# Altium schematic sheet 0002_INDEX -1.SchDoc
size 891 x 558 mm
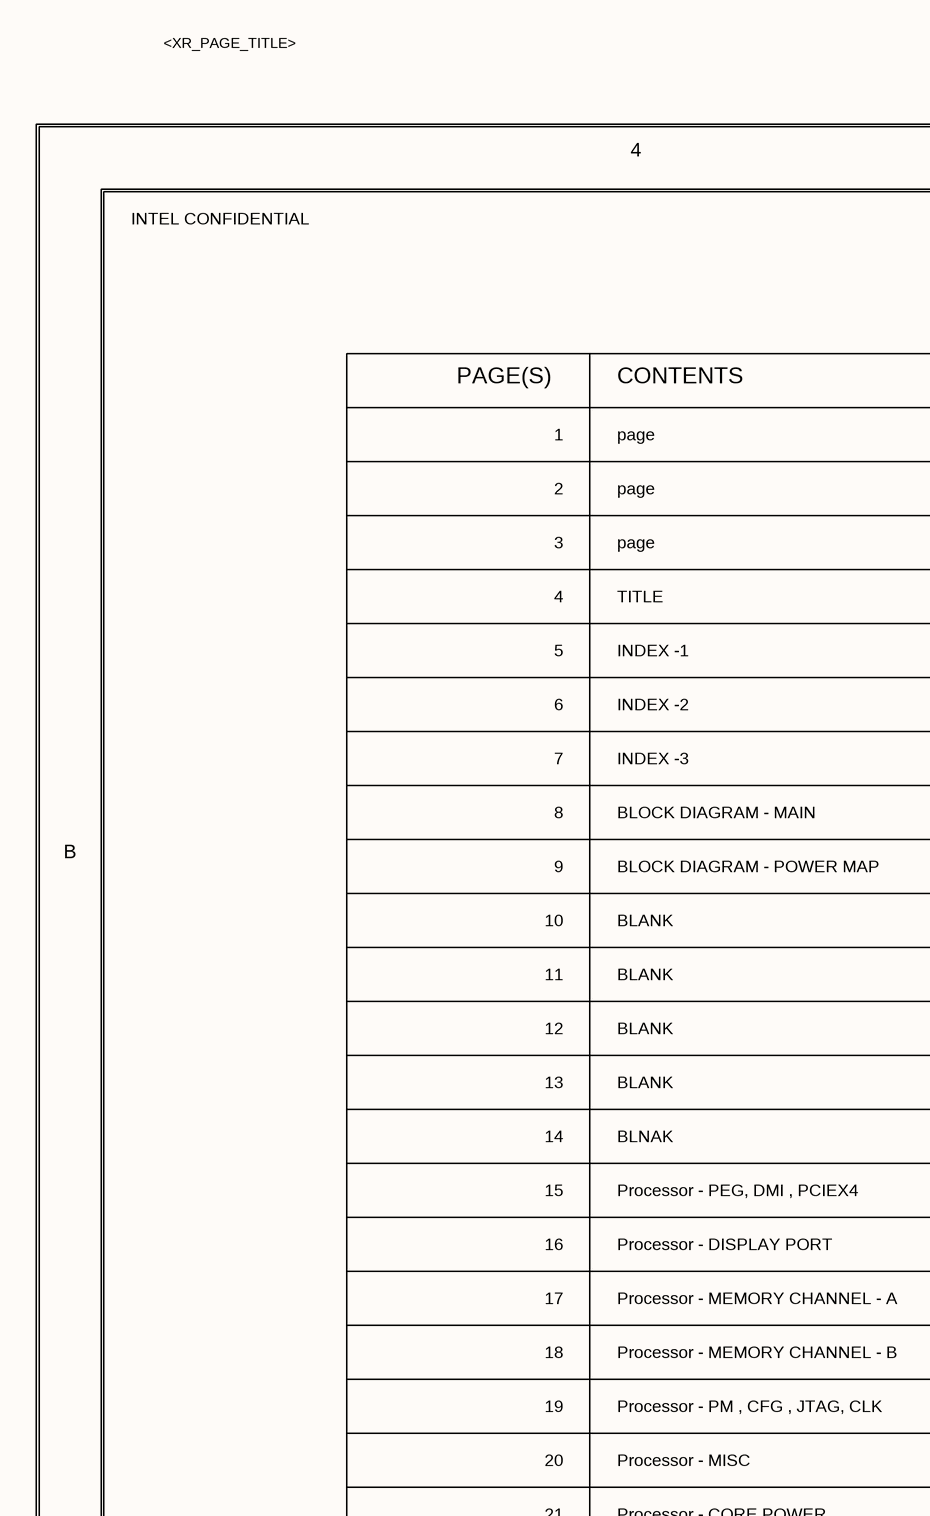
[diagram p0: 0002_INDEX -1.SchDoc, top left]
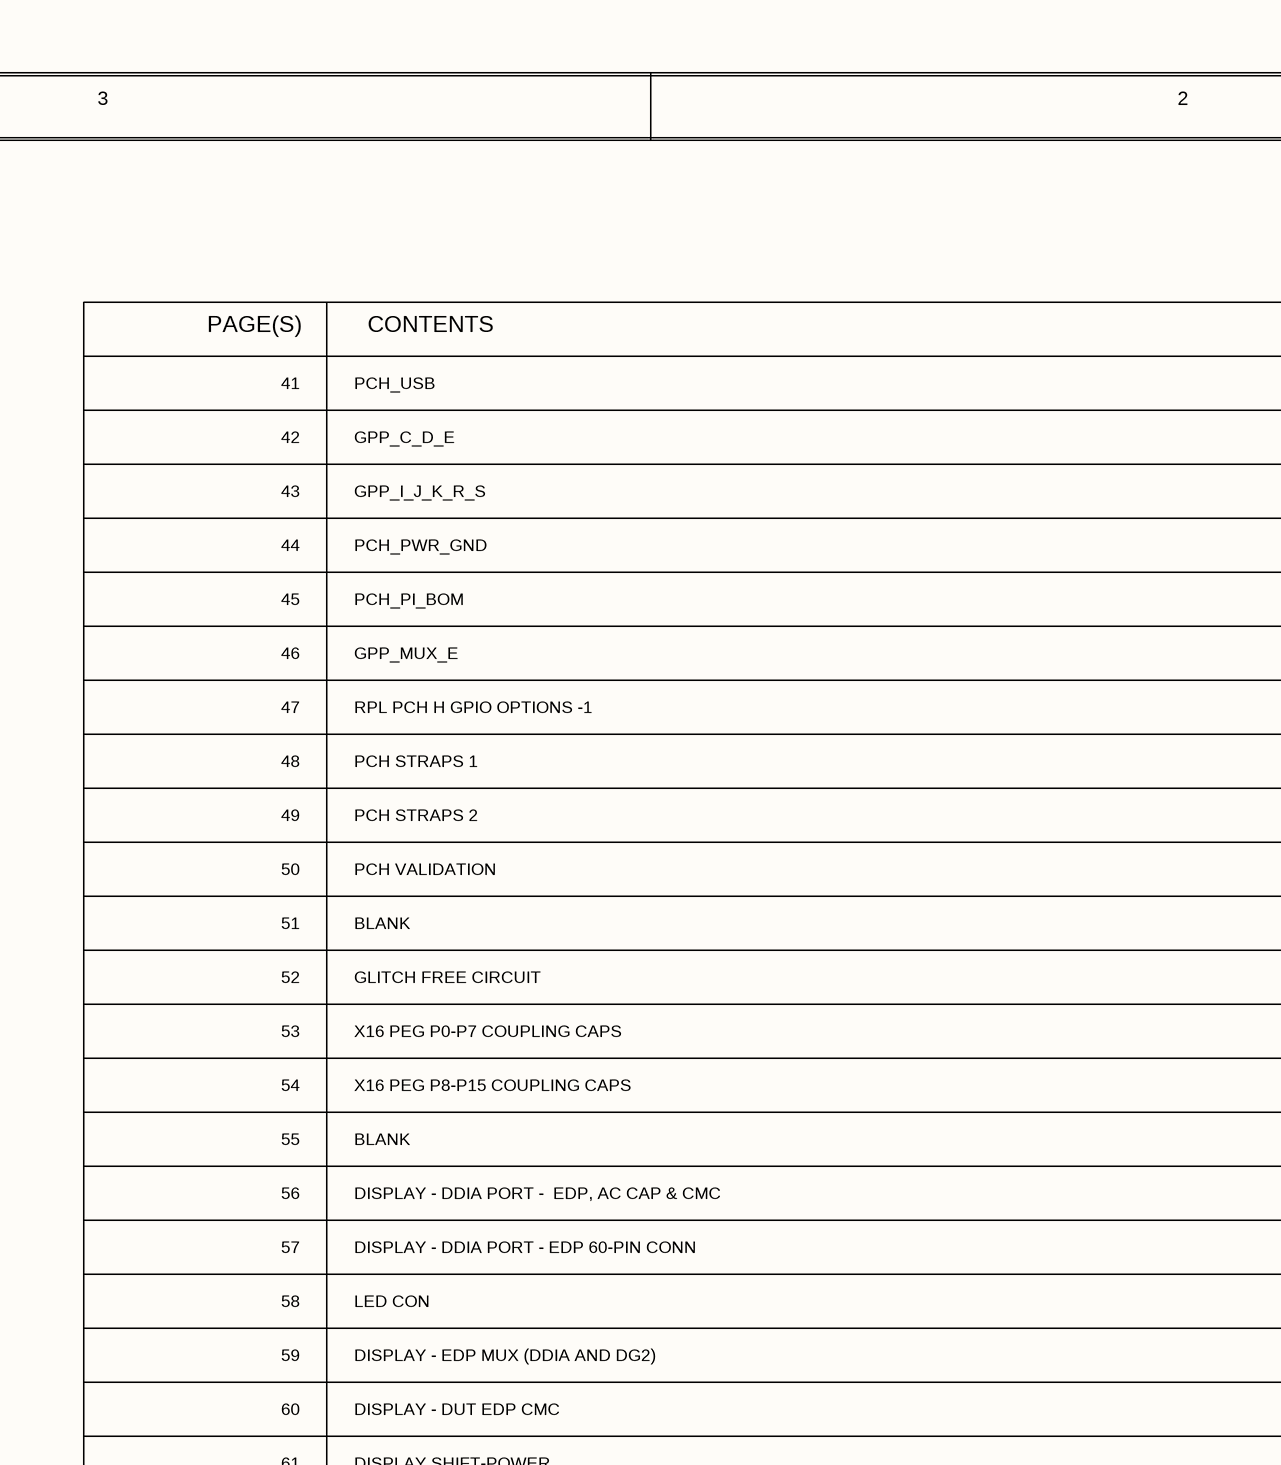
[diagram p1: 0002_INDEX -1.SchDoc, top middle]
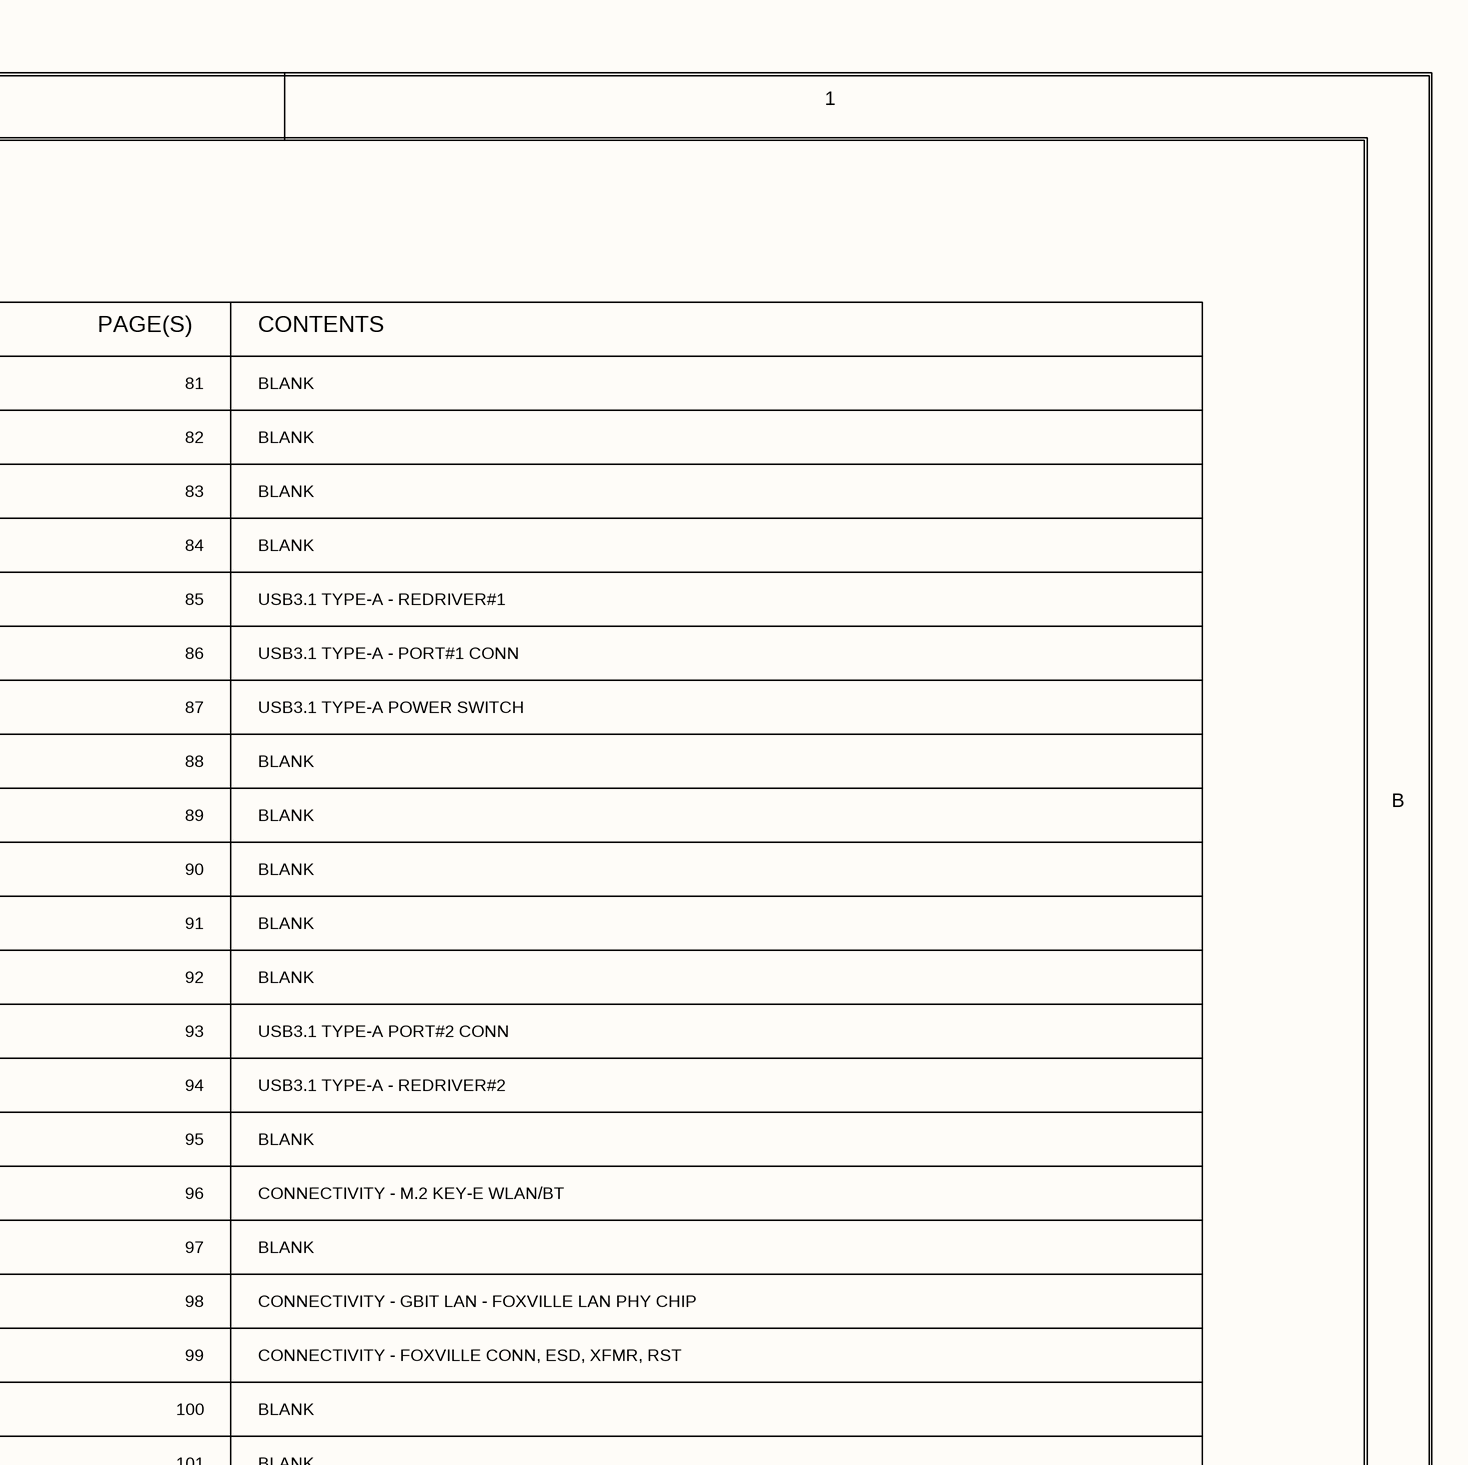
[diagram p2: 0002_INDEX -1.SchDoc, top right]
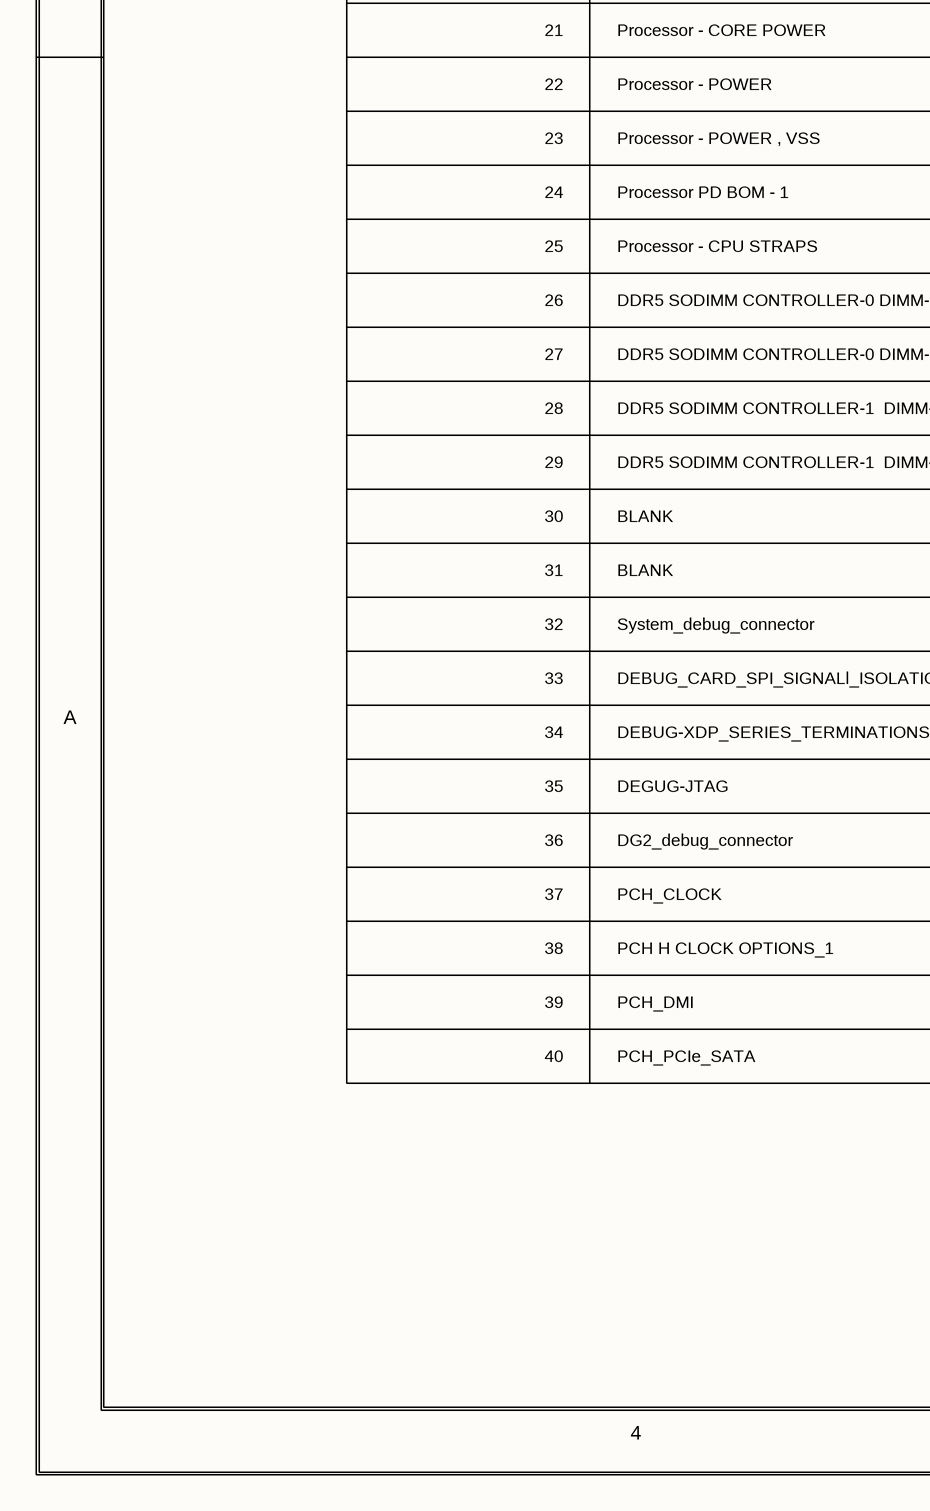
[diagram p3: 0002_INDEX -1.SchDoc, bottom left]
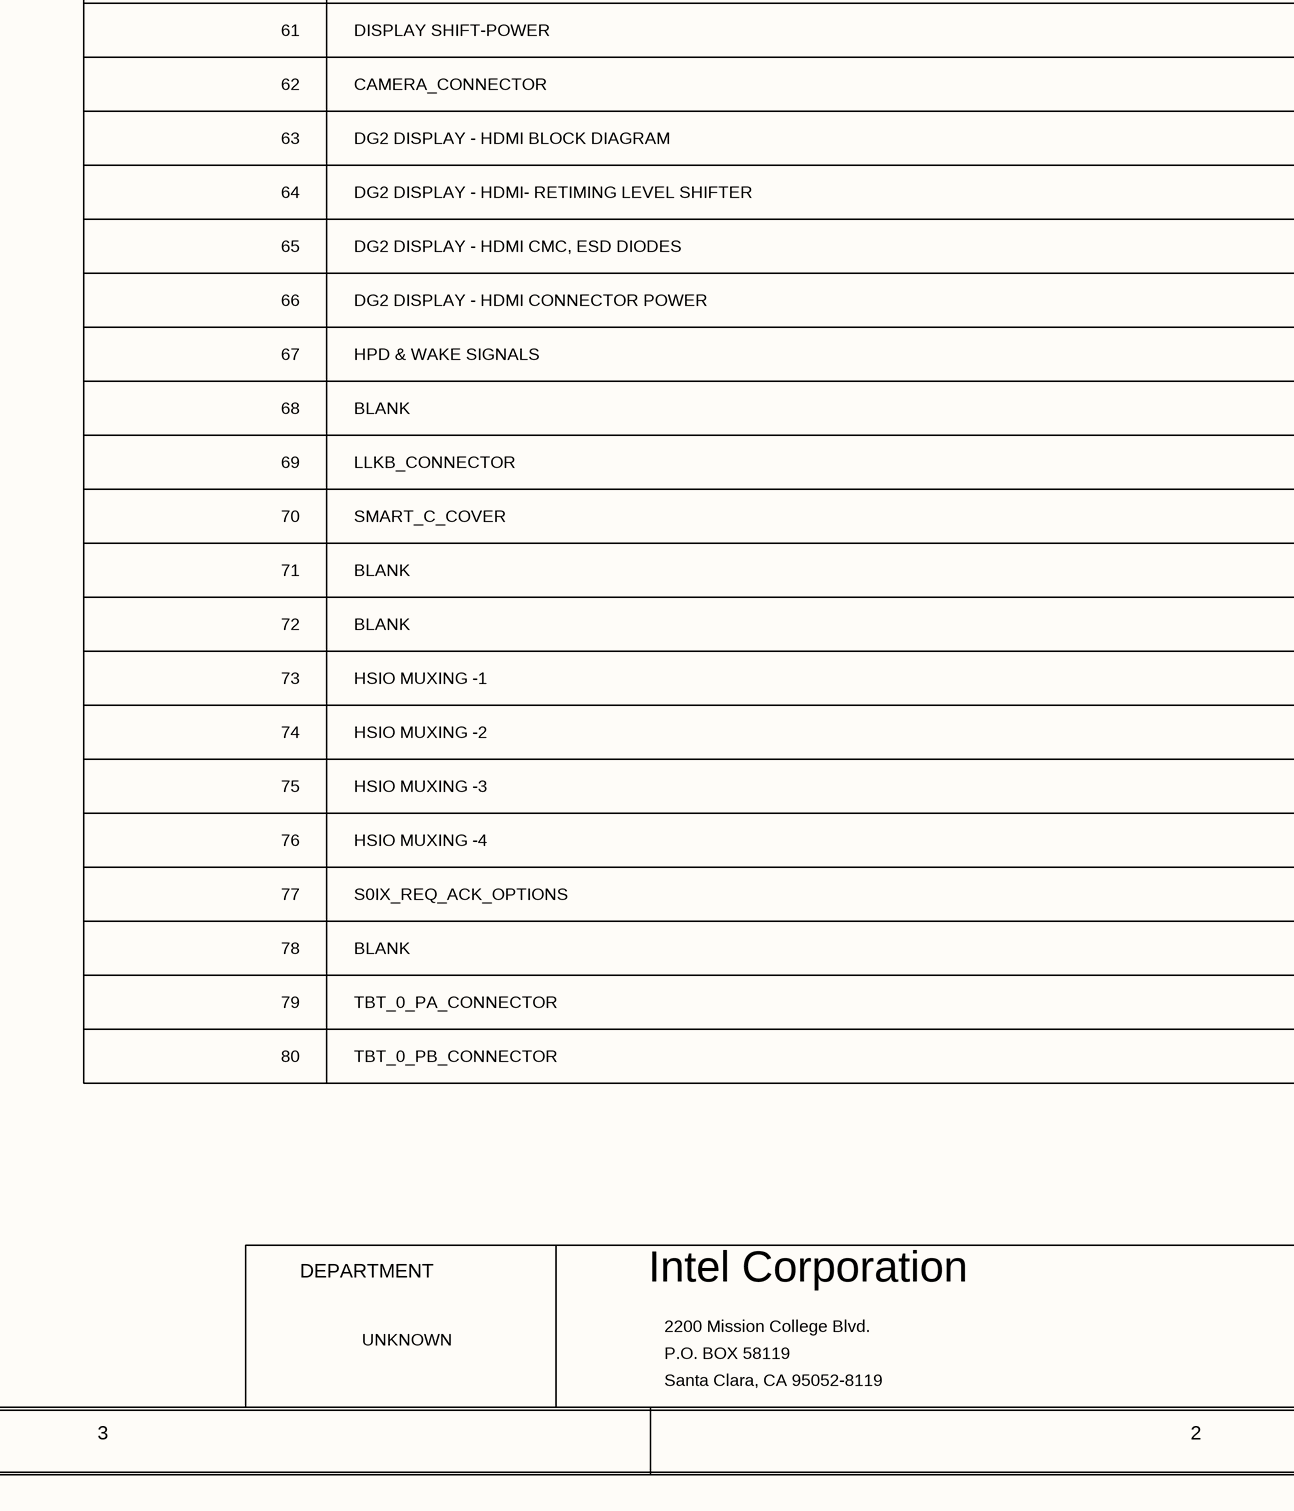
[diagram p4: 0002_INDEX -1.SchDoc, bottom middle]
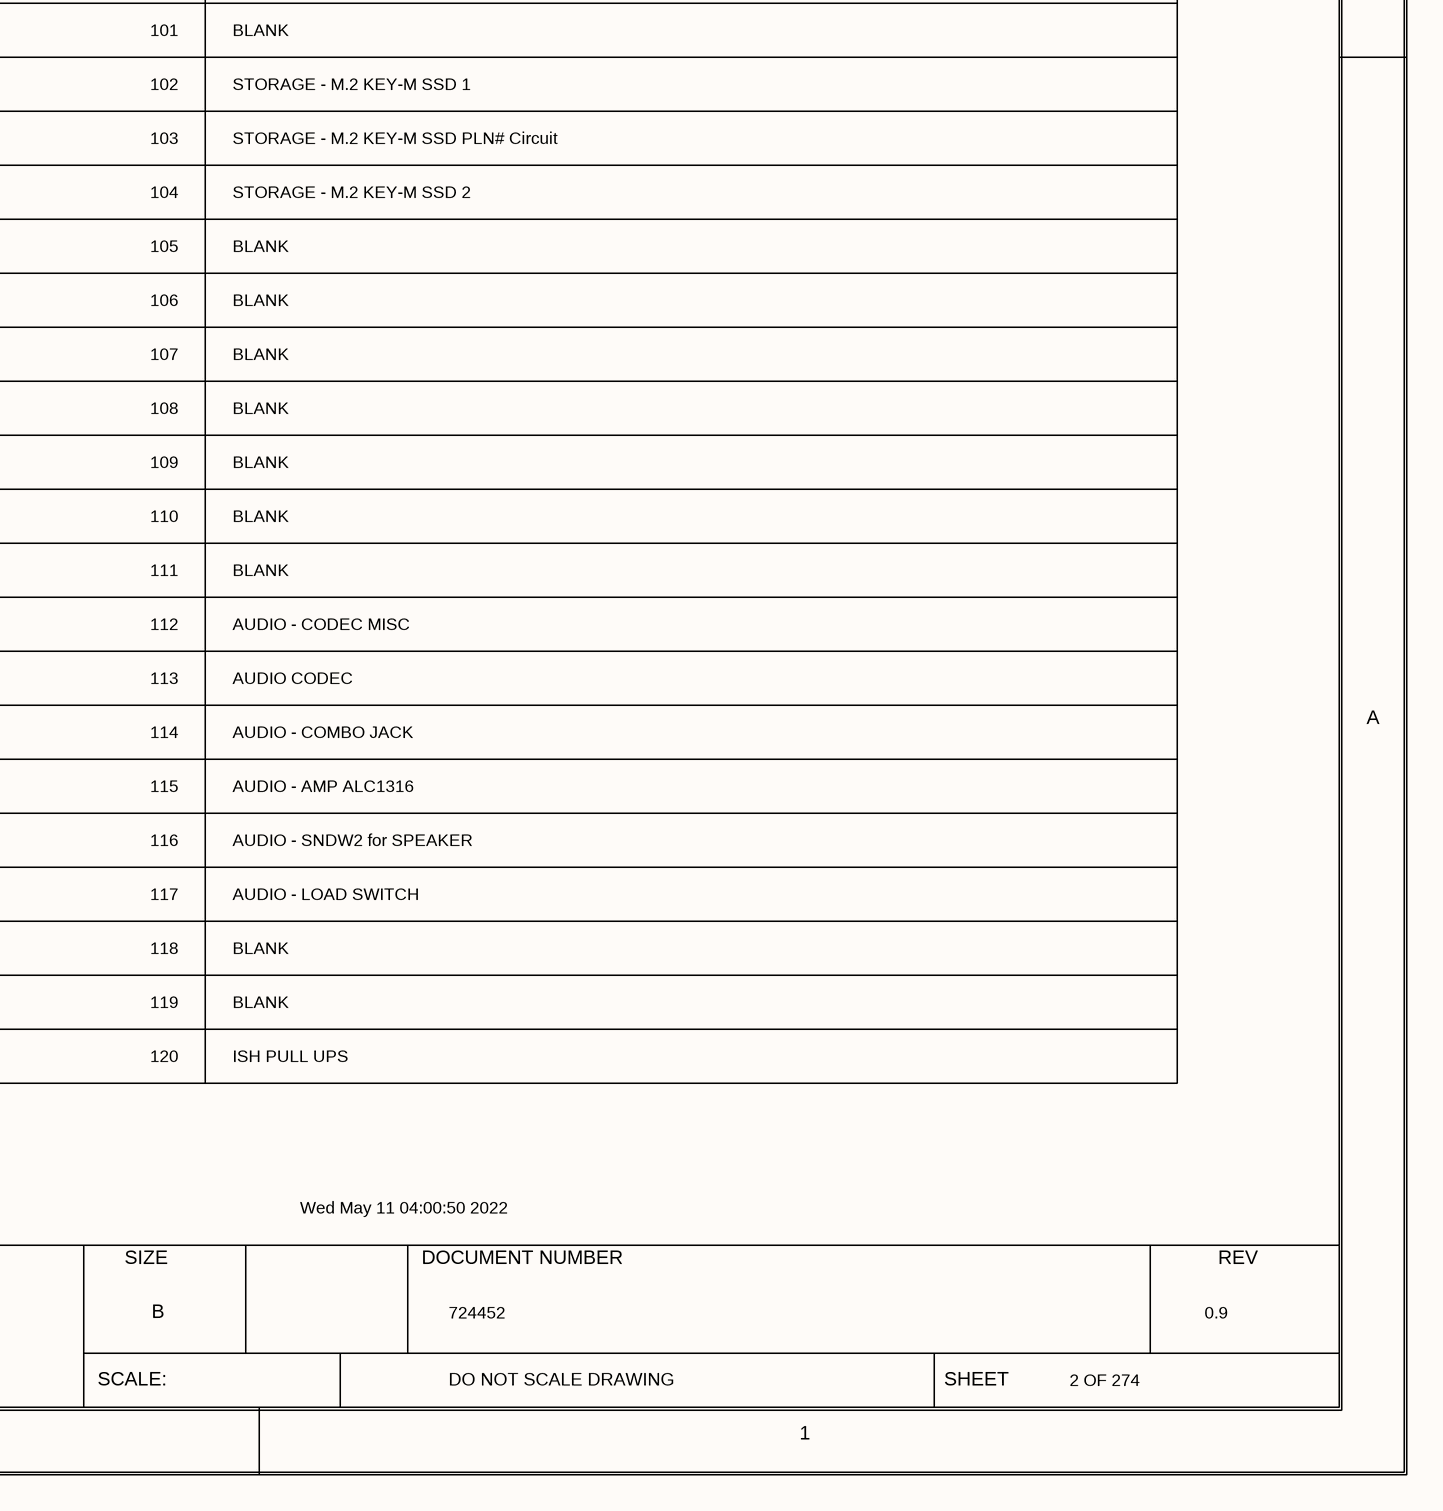
[diagram p5: 0002_INDEX -1.SchDoc, bottom right]

## Notes on the sheet
- <XR_PAGE_TITLE>
- 4
- 3
- 2
- 1
- INTEL CONFIDENTIAL
- PAGE(S)
- CONTENTS
- page
- 41
- PCH_USB
- 81
- BLANK
- 42
- GPP_C_D_E
- 82
- 43
- GPP_I_J_K_R_S
- 83
- 5
- TITLE
- INDEX -1
- 44
- 45
- PCH_PI_BOM
- PCH_PWR_GND
- 85
- 84
- USB3.1 TYPE-A - REDRIVER#1
- 6
- INDEX -2
- 46
- GPP_MUX_E
- 86
- USB3.1 TYPE-A - PORT#1 CONN
- 7
- INDEX -3
- 47
- RPL PCH H GPIO OPTIONS -1
- 87
- USB3.1 TYPE-A POWER SWITCH
- B
- 8
- BLOCK DIAGRAM - MAIN
- 48
- PCH STRAPS 1
- 88
- 10
- 9
- BLOCK DIAGRAM - POWER MAP
- 49
- 50
- PCH STRAPS 2
- PCH VALIDATION
- 89
- 90
- 11
- 51
- 91
- 12
- 52
- GLITCH FREE CIRCUIT
- 92
- 13
- 53
- X16 PEG P0-P7 COUPLING CAPS
- 93
- USB3.1 TYPE-A PORT#2 CONN
- 14
- 15
- BLNAK
- Processor - PEG, DMI , PCIEX4
- 55
- 54
- X16 PEG P8-P15 COUPLING CAPS
- 94
- 95
- USB3.1 TYPE-A - REDRIVER#2
- 16
- Processor - DISPLAY PORT
- 56
- DISPLAY - DDIA PORT -  EDP, AC CAP & CMC
- 96
- CONNECTIVITY - M.2 KEY-E WLAN/BT
- 17
- Processor - MEMORY CHANNEL - A
- 57
- DISPLAY - DDIA PORT - EDP 60-PIN CONN
- 97
- 18
- Processor - MEMORY CHANNEL - B
- 58
- LED CON
- 98
- CONNECTIVITY - GBIT LAN - FOXVILLE LAN PHY CHIP
- 19
- 20
- Processor - PM , CFG , JTAG, CLK
- Processor - MISC
- 59
- 60
- DISPLAY - EDP MUX (DDIA AND DG2)
- DISPLAY - DUT EDP CMC
- 100
- 99
- CONNECTIVITY - FOXVILLE CONN, ESD, XFMR, RST
- 21
- Processor - CORE POWER
- 61
- DISPLAY SHIFT-POWER
- 101
- 22
- Processor - POWER
- 62
- CAMERA_CONNECTOR
- 102
- STORAGE - M.2 KEY-M SSD 1
- 23
- Processor - POWER , VSS
- 63
- DG2 DISPLAY - HDMI BLOCK DIAGRAM
- 103
- STORAGE - M.2 KEY-M SSD PLN# Circuit
- 24
- 25
- Processor PD BOM - 1
- Processor - CPU STRAPS
- 64
- 65
- DG2 DISPLAY - HDMI CMC, ESD DIODES
- DG2 DISPLAY - HDMI- RETIMING LEVEL SHIFTER
- 105
- 104
- STORAGE - M.2 KEY-M SSD 2
- 26
- DDR5 SODIMM CONTROLLER-0 DIMM-0
- 66
- DG2 DISPLAY - HDMI CONNECTOR POWER
- 106
- 27
- 67
- HPD & WAKE SIGNALS
- 107
- 28
- DDR5 SODIMM CONTROLLER-1  DIMM-0
- 68
- 108
- 29
- 30
- 70
- 69
- SMART_C_COVER
- LLKB_CONNECTOR
- 110
- 109
- 31
- 71
- 111
- 32
- System_debug_connector
- 72
- 112
- AUDIO - CODEC MISC
- A
- 33
- DEBUG_CARD_SPI_SIGNALl_ISOLATION
- 73
- HSIO MUXING -1
- 113
- AUDIO CODEC
- 34
- 35
- DEBUG-XDP_SERIES_TERMINATIONS
- DEGUG-JTAG
- 75
- 74
- HSIO MUXING -3
- HSIO MUXING -2
- 115
- 114
- AUDIO - AMP ALC1316
- AUDIO - COMBO JACK
- 36
- DG2_debug_connector
- 76
- HSIO MUXING -4
- 116
- AUDIO - SNDW2 for SPEAKER
- 37
- PCH_CLOCK
- 77
- S0IX_REQ_ACK_OPTIONS
- 117
- AUDIO - LOAD SWITCH
- 38
- PCH H CLOCK OPTIONS_1
- 78
- 118
- 40
- 39
- PCH_DMI
- PCH_PCIe_SATA
- 80
- 79
- TBT_0_PA_CONNECTOR
- TBT_0_PB_CONNECTOR
- 119
- 120
- ISH PULL UPS
- Wed May 11 04:00:50 2022
- SIZE
- DOCUMENT NUMBER
- REV
- DEPARTMENT
- Intel Corporation
- 2200 Mission College Blvd.
- 724452
- 0.9
- UNKNOWN
- P.O. BOX 58119
- Santa Clara, CA 95052-8119
- SCALE:
- DO NOT SCALE DRAWING
- SHEET
- 2 OF 274